# EAGLE design imu_base (EAGLE 9.4.2)
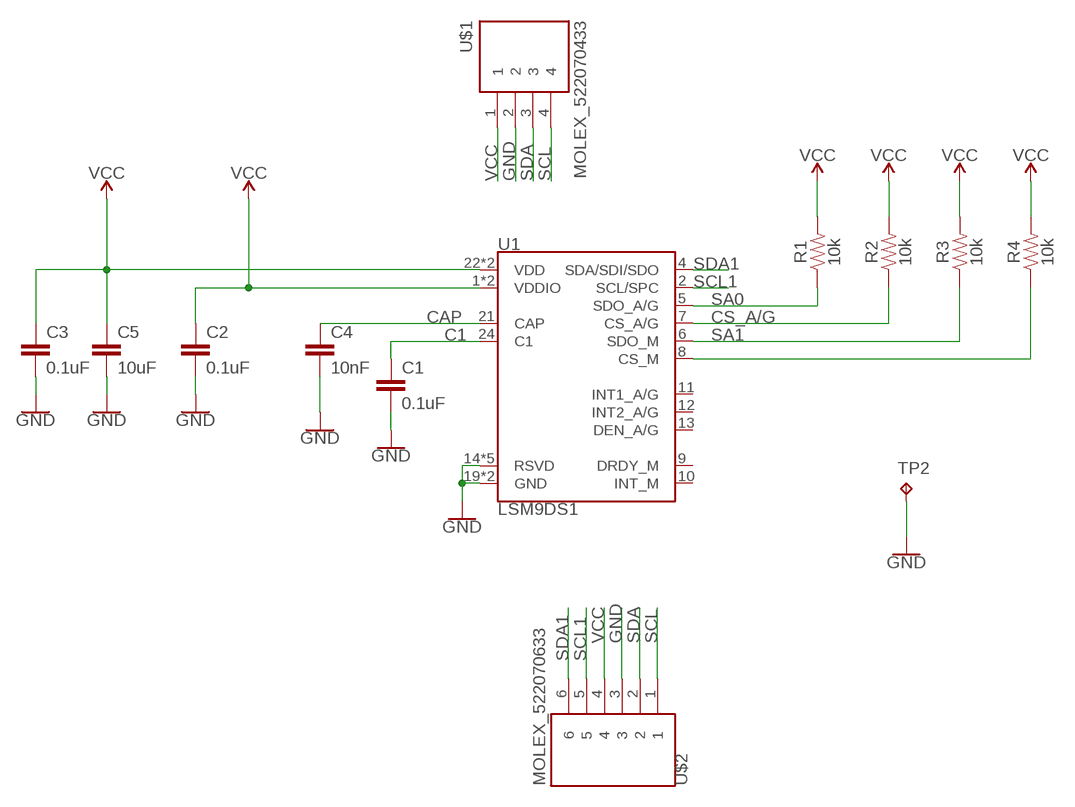
[diagram p0: schematic, sheet 1]

## Parts
C1  0.1uF  0.1UF-0603-25V-(+80/-20%)  [0603]
C2  0.1uF  0.1UF-0603-25V-(+80/-20%)  [0603]
C3  0.1uF  0.1UF-0603-25V-(+80/-20%)  [0603]
C4  10nF  10NF-0603-50V-10%  [0603]
C5  10uF  10UF-0603-6.3V-20%  [0603]
R1  10k  10KOHM-0603-1/10W-1%  [0603]
R2  10k  10KOHM-0603-1/10W-1%  [0603]
R3  10k  10KOHM-0603-1/10W-1%  [0603]
R4  10k  10KOHM-0603-1/10W-1%  [0603]
TP2  TPB2,54  [B2,54]
U1  LSM9DS1  [LGA-24-3.5X3]
U$1  MOLEX_522070433  [MOLEX4_1MM]
U$2  MOLEX_522070633  [MOLEX6_1MM]

## Nets
C1: C1.1 U1.24(C1)
CAP: C4.1 U1.21(CAP)
CS_A/G: R2.1 U1.7(CS_A/G)
CS_M: R4.1 U1.8(CS_M)
GND: C1.2 C2.2 C3.2 C4.2 C5.2 TP2.TP U1.14(RSVD) U1.15(RSVD) U1.16(RSVD) U1.17(RSVD) U1.18(RSVD) U1.19(GND) U1.20(GND) U$1.2 U$2.3
SA0: R1.1 U1.5(SDO_A/G)
SA1: R3.1 U1.6(SDO_M)
SCL: U$1.4 U$2.1
SCL1: U1.2(SCL/SPC) U$2.5
SDA: U$1.3 U$2.2
SDA1: U1.4(SDA/SDI/SDO) U$2.6
VCC: C2.1 C3.1 C5.1 R1.2 R2.2 R3.2 R4.2 U1.1(VDDIO) U1.3(VDDIO) U1.22(VDD) U1.23(VDD) U$1.1 U$2.4
Unconnected: U1.9(DRDY_M) U1.10(INT_M) U1.11(INT1_A/G) U1.12(INT2_A/G) U1.13(DEN_A/G)

## Library data of the parts
C1-C3 = SparkFun-Capacitors:0.1UF: 0.1µF ceramic capacitors A capacitor is a passive two-terminal electrical component used to store electrical energy temporarily in an electric field.; PROD_ID: CAP-00810
C4 = SparkFun-Capacitors:10NF: 0.01uF/10nF/10,000pF ceramic capacitors A capacitor is a passive two-terminal electrical component used to store electrical energy temporarily in an electric field. CAP-09321; PROD_ID: CAP-00867
C5 = SparkFun-Capacitors:10UF: 10.0µF ceramic capacitors A capacitor is a passive two-terminal electrical component used to store electrical energy temporarily in an electric field.; PROD_ID: CAP-11015
R1-R4 = SparkFun-Resistors:10KOHM: 10kΩ resistor A resistor is a passive two-terminal electrical component that implements electrical resistance as a circuit element. Resistors act to reduce current flow, and, at the same time, act to lower voltage levels within circuits. - Wikipedia; PROD_ID: RES-00824
TP2 = testpad:TP: Test pad
U1 = SparkFun-Sensors:LSM9DS1: ST Microelectronics LSM9DS1 9DOF IMU - Accelerometer, Gyroscope & Magnetometer The LSM9DS1 is a versatile, motion-sensing system-in-a-chip. It houses a 3-axis accelerometer, 3-axis gyroscope, and 3-axis magnetometer – nine degrees of freedom (9DOF) in a single IC! The LSM9DS1 is equipped with a digital interface, but even that is flexible: it supports both I2C and SPI, so you’ll be hard-pressed to find a microcontroller it doesn’t work with. Datasheet <https://cdn.sparkfun.com/assets/learn_tutorials/3/7/3/LSM9DS1_Datasheet.pdf> SparkFun Products SparkFun 9 Degrees of Freedom IMU Breakout - LSM9DS1 <https://www.sparkfun.com/products/13284> (SEN-13284) SparkFun Photon IMU Shield <https://www.sparkfun.com/products/13629> (DEV-13629); PROD_ID: IC-12536
U$1 = custom:MOLEX_522070433
U$2 = custom:MOLEX_522070633

## Board
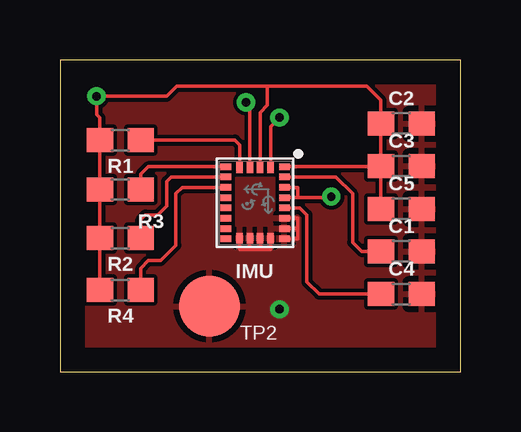
[diagram p1: board, top side]
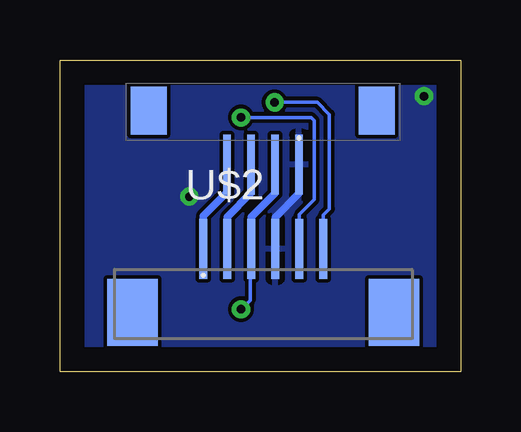
[diagram p2: board, bottom side, seen from below]

Size 16.69 x 13.02 mm. Coordinates in mm from the lower left corner, seen from the top.
Outline: 0,0 16.69,0 16.69,13.02 0,13.02 0,0
Copper layers (1*16): Top 0.035mm / dielectric 1.5mm / Bottom 0.035mm
Design rules "default": minimum track width 6mil, minimum drill 0.35mm, track to track 6mil, track to pad 6mil, pad to pad 6mil, via to via 6mil, smd to smd 6mil, copper to edge 40mil, drill to drill 6mil, minimum pad ring 10mil, minimum via ring 8mil, stop-mask expansion 4mil, vias tented up to drill 0mil, thermal gap 10mil

### Footprints (pad centres in the part's own frame; a part is rotated, then mirrored left to right if it is on the bottom)
0603 = smd 1.1 x 1: 1 -0.85,0; 2 0.85,0
B2,54 = smd 2.54 x 2.54: TP 0,0
LGA-24-3.5X3 = smd 0.27 x 0.45: 1 -1.505,1.225; 6 -1.505,-1.225; 7 -1.075,-1.225; 8 -0.645,-1.225; 9 -0.215,-1.225; 10 0.215,-1.225; 11 0.645,-1.225; 12 1.075,-1.225; 13 1.505,-1.225; 18 1.505,1.225; 19 1.075,1.225; 20 0.645,1.225; 21 0.215,1.225; 22 -0.215,1.225; 23 -0.645,1.225; 24 -1.075,1.225 | smd 0.45 x 0.27: 2 -1.475,0.645; 3 -1.475,0.215; 4 -1.475,-0.215; 5 -1.475,-0.645; 14 1.475,-0.645; 15 1.475,-0.215; 16 1.475,0.215; 17 1.475,0.645
MOLEX4_1MM = smd 0.32 x 2.5: 1 0,1.2; 2 1,1.2; 3 2,1.2; 4 3,1.2 | smd 1.5 x 2: P$5 6.25,-1.05; P$6 -3.25,-1.05
MOLEX6_1MM = smd 0.32 x 2.5: 1 0,1.2; 2 1,1.2; 3 2,1.2; 4 3,1.2; 5 4,1.2; 6 5,1.2 | smd 2.1 x 2.8: P$7 -2.95,-1.45; P$8 7.95,-1.45

### Placement (x,y rotation side)
C1  14.22,5.03 0 top
C2  14.22,10.36 0 top
C3  14.22,8.59 0 top
C4  14.22,3.25 0 top
C5  14.22,6.81 0 top
R1  2.51,9.68 180 top
R2  2.51,5.59 180 top
R3  2.51,7.62 180 top
R4  2.51,3.43 180 top
TP2  6.22,2.74 0 top
U1  8.13,7.06 270 top
U$1  6.73,9.86 180 bottom
U$2  10.72,3.94 0 bottom

### Tracks (layer width: path | path; a pad name or v marks a point on that pad's centre or on a via)
C1
  Top 0.152: U1.24 11.5,8.14 12.19,7.44 12.19,5.41 12.57,5.03 C1.1
CAP
  Top 0.152: U1.21 9.99,6.85 10.29,6.55 10.29,3.76 10.8,3.25 C4.1
CS_A/G
  Top 0.152: R2.1 3.37,6.36 3.56,6.55 4.06,6.55 4.45,6.93 4.45,7.95 4.63,8.14 U1.7
CS_M
  Top 0.152: R4.1 3.37,4.33 3.68,4.65 4.19,4.65 4.83,5.28 4.83,7.44 5.09,7.71 U1.8
GND  (via drill 0.35)
  Top 0.152: U1.14 7.49,5.58 7.49,5.11 7.91,5.11 | U1.15 7.91,5.11 | 7.91,5.11 8.36,5.11 | 8.36,5.11 8.76,5.11 8.77,5.12 U1.17 | U1.16 8.36,5.57 8.36,5.11 | U1.18 9.91,5.56 9.91,5.99 | 9.91,5.99 U1.19 | 9.91,5.99 9.91,6.42 U1.20
  Bottom 0.152: U$2.3 8.76,5.09 8.76,3 v9.14,2.62
  Bottom 0.305: U$1.2 7.73,7.45 8.72,6.46 U$2.3
  pour Top: 0.38,12.52 16.26,12.52 16.26,0.46 0.38,0.46
SA0
  Top 0.152: R1.1 7.29,9.68 7.49,9.47 7.49,8.55 U1.5
SA1
  Top 0.152: U1.6 3.68,8.57 3.37,8.26 R3.1
SCL
  Bottom 0.305: U$1.4 9.73,7.49 10.72,6.5 U$2.1
SCL1  (via drill 0.35)
  Top 0.152: v9.14,10.62 8.77,10.25 U1.2
  Bottom 0.152: U$2.5 6.72,6.57 6.1,7.19 6.1,10.49 6.22,10.62 v9.14,10.62
SDA
  Bottom 0.305: U$1.3 8.73,7.46 9.72,6.48 U$2.2
SDA1  (via drill 0.35)
  Top 0.152: v7.75,11.25 7.91,11.09 U1.4
  Bottom 0.152: U$2.6 5.72,6.55 5.46,6.81 5.46,10.74 5.97,11.25 v7.75,11.25
VCC  (via drill 0.35)
  Top 0.152: R4.2 R2.2 R3.2 R1.2 1.66,10.6 1.52,10.74 v1.52,11.51 4.45,11.51 4.87,11.93 8.64,11.93 | C3.1 C2.1 13.37,11.34 12.79,11.93 8.64,11.93 | C3.1 C5.1 | U1.3 8.34,10.83 8.64,11.13 8.64,11.93 | U1.22 9.91,7.28 | 9.91,7.28 9.91,7.71 U1.23 | v11.3,7.32 11.26,7.28 9.91,7.28 | U1.1 13.36,8.57 C3.1
  Bottom 0.305: U$1.1 6.73,7.44 7.72,6.45 U$2.4
  pour Bottom: 0.38,12.52 16.26,12.52 16.26,0.46 0.38,0.46

### Text on the board
tPlace: IMU